# EAGLE design 13VSOIC2DIL-20110605-01 (EAGLE 5.11)
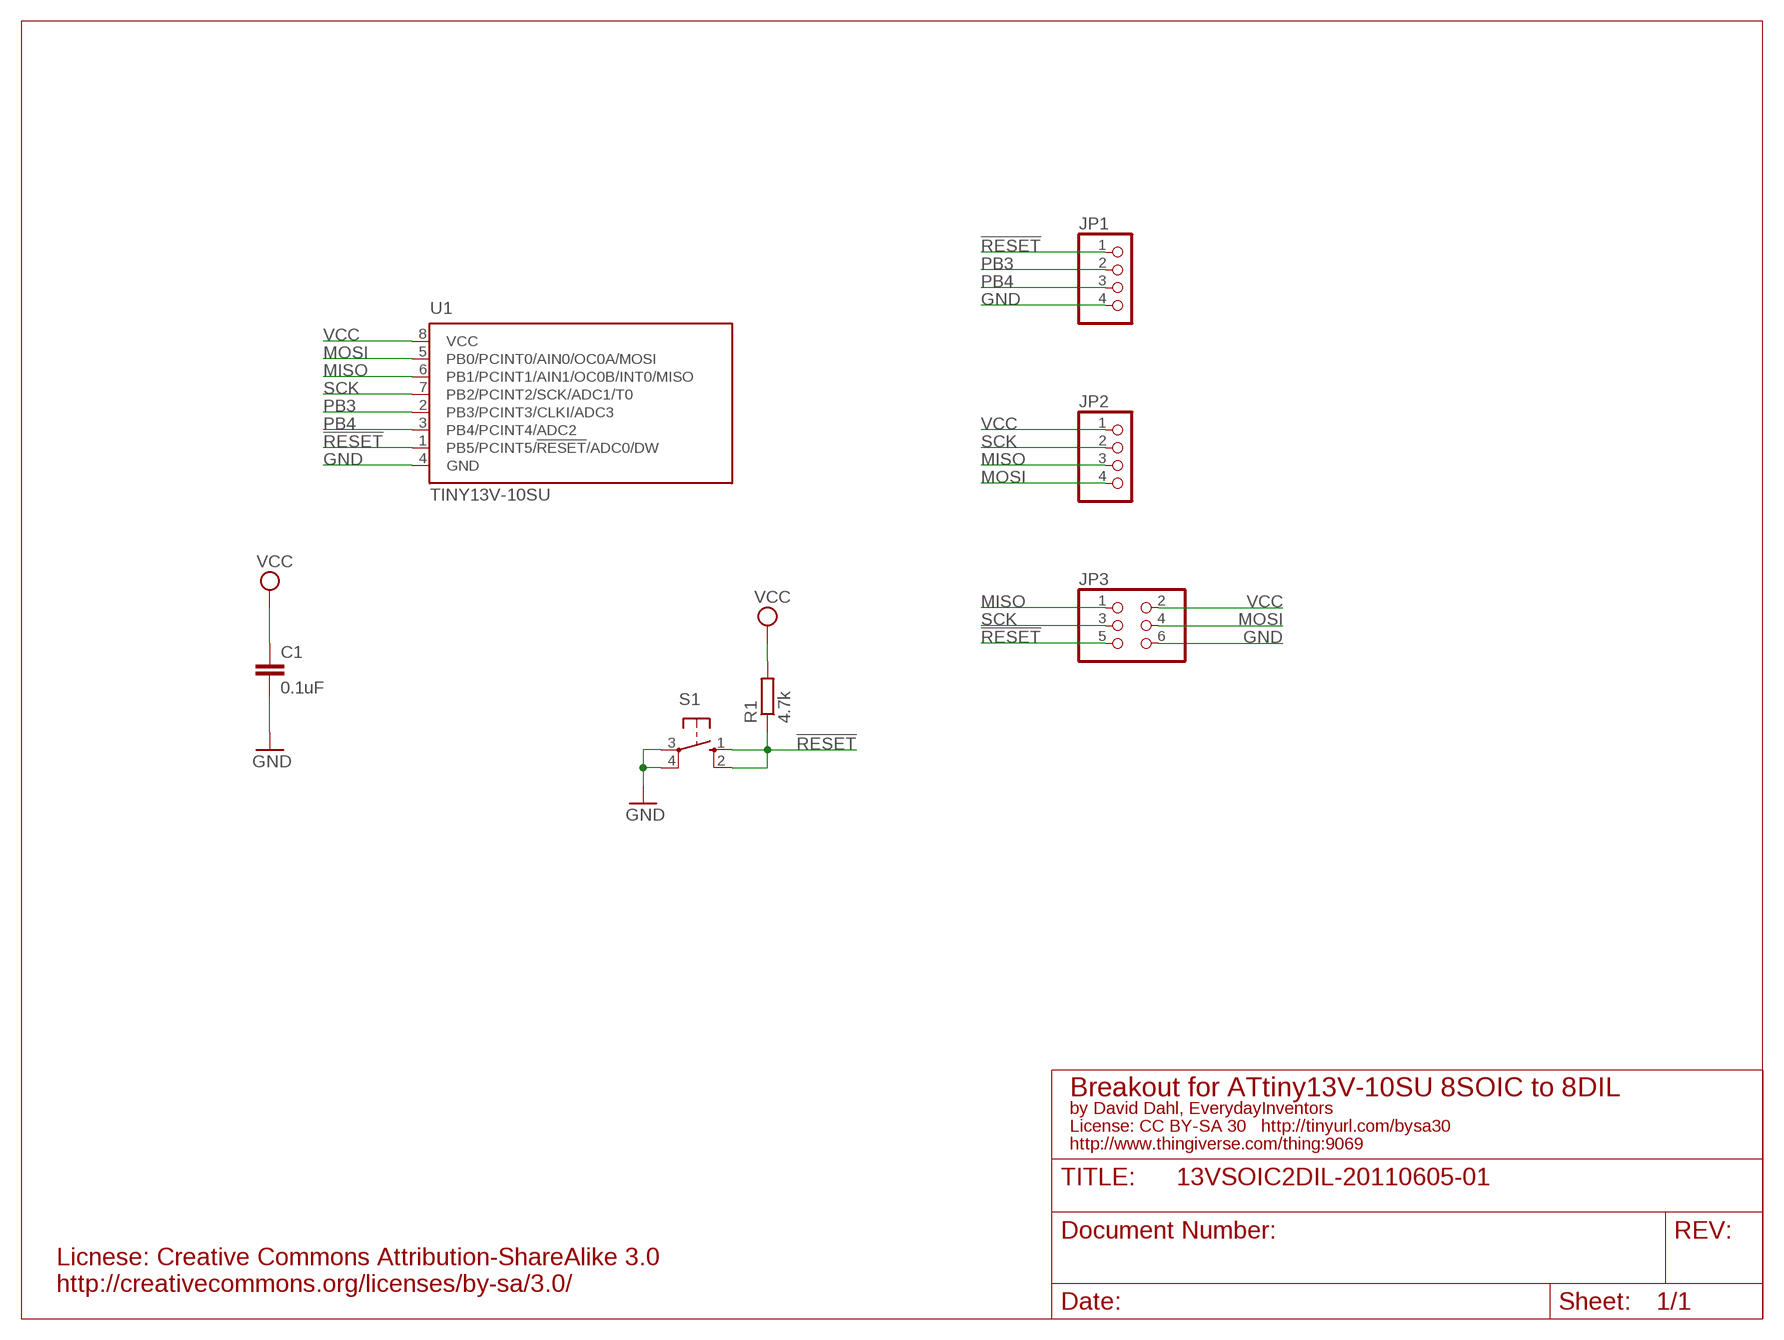
[diagram p0: schematic, sheet 1]

## Parts
C1  0.1uF  C-EU025-025X050  [C025-025X050]
JP1  PINHD-1X04_2.54-S  [1X04-S]
JP2  PINHD-1X04_2.54-S  [1X04-S]
JP3  PINHD-2X3  [2X03]
R1  4.7k  R-EU_0207/10  [0207/10]
S1  10-XX  [B3F-10XX]
U1  TINY13V-10SU  [8S2]

## Nets
!RESET: JP1.1 JP3.5 R1.1 S1.1(S) S1.2(S1) U1.1(PB5/PCINT5/!RESET!/ADC0/DW)
GND: C1.2 JP1.4 JP3.6 S1.3(P) S1.4(P1) U1.4(GND)
MISO: JP2.3 JP3.1 U1.6(PB1/PCINT1/AIN1/OC0B/INT0/MISO)
MOSI: JP2.4 JP3.4 U1.5(PB0/PCINT0/AIN0/OC0A/MOSI)
PB3: JP1.2 U1.2(PB3/PCINT3/CLKI/ADC3)
PB4: JP1.3 U1.3(PB4/PCINT4/ADC2)
SCK: JP2.2 JP3.3 U1.7(PB2/PCINT2/SCK/ADC1/T0)
VCC: C1.1 JP2.1 JP3.2 R1.2 U1.8(VCC)

## Notes on the sheet
- Breakout for ATtiny13V-10SU 8SOIC to 8DIL
- by David Dahl, EverydayInventors
- License: CC BY-SA 30   http://tinyurl.com/bysa30
- http://www.thingiverse.com/thing:9069
- Licnese: Creative Commons Attribution-ShareAlike 3.0
- http://creativecommons.org/licenses/by-sa/3.0/

## Library data of the parts
C1 = rcl:C-EU: CAPACITOR, European symbol
JP1 JP2 = pinhead-2:PINHD-1X04: PIN HEADER
JP3 = pinhead:PINHD-2X3: PIN HEADER
R1 = rcl:R-EU_: RESISTOR, European symbol
S1 = switch-omron:10-XX: OMRON SWITCH; MPN: B3F-1000; OC_FARNELL: 176432; OC_NEWARK: 36M3542
U1 = atmel:TINY13: 8-bit AVR Microcontroller with 1K Bytes In-System Programmable Flash Source: http://www.atmel.com/dyn/resources/prod_documents/2535S.pdf; MPN: ATTINY13V-10SU; OC_FARNELL: 9171584; OC_NEWARK: 96K6524

## Board
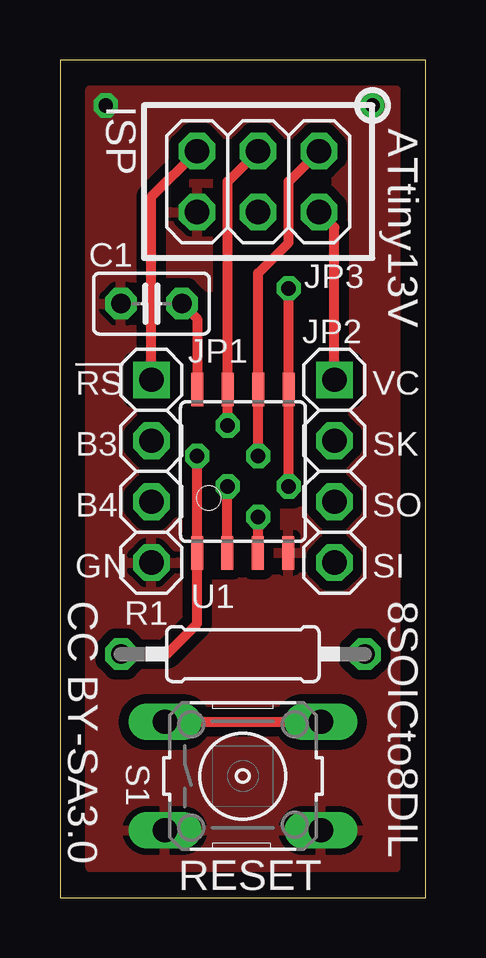
[diagram p1: board, top side]
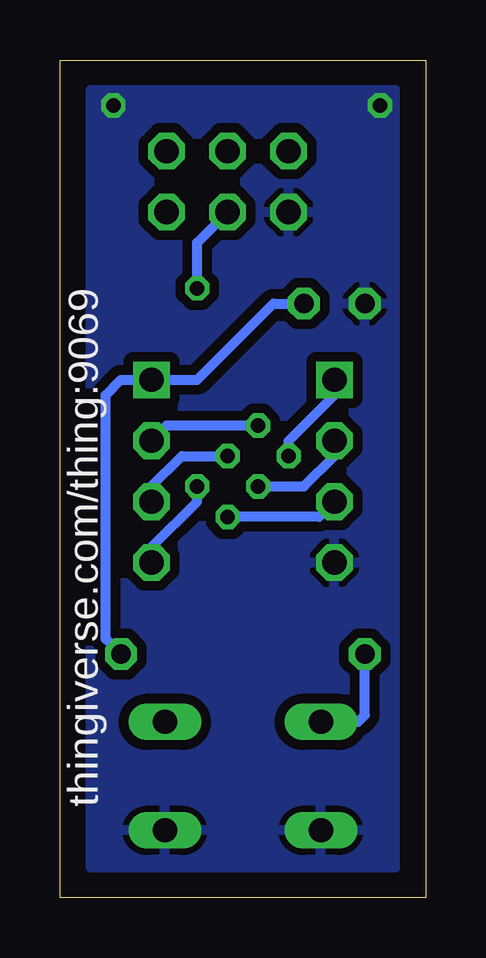
[diagram p2: board, bottom side, seen from below]

Size 15.24 x 34.91 mm. Coordinates in mm from the lower left corner, seen from the top.
Outline: 0,0 15.24,0 15.24,34.91 0,34.91 0,0
Copper layers (1*16): Top 0.035mm / dielectric 1.5mm / Bottom 0.035mm
Design rules "default *": minimum track width 10mil, minimum drill 24mil, track to track 8mil, track to pad 8mil, pad to pad 8mil, via to via 8mil, smd to smd 8mil, copper to edge 40mil, drill to drill 8mil, minimum pad ring 10mil, minimum via ring 8mil, stop-mask expansion 4mil, vias tented up to drill 24mil, thermal gap 10mil

### Footprints (pad centres in the part's own frame; a part is rotated, then mirrored left to right if it is on the bottom)
C025-025X050 = drill 0.813 octagon: 1 -1.27,0; 2 1.27,0
1X04-S = drill 1.016 square: 1 -3.81,0 | drill 1.016 octagon: 2 -1.27,0; 3 1.27,0; 4 3.81,0
2X03 = drill 1.016 octagon: 1 -2.54,-1.27; 2 -2.54,1.27; 3 0,-1.27; 4 0,1.27; 5 2.54,-1.27; 6 2.54,1.27
0207/10 = drill 0.813 octagon: 1 -5.08,0; 2 5.08,0
B3F-10XX = drill 1.016 long: 1 -3.251,2.261; 2 3.251,2.261; 3 -3.251,-2.261; 4 3.251,-2.261
8S2 = smd 0.5 x 1.4: 1 -1.905,-3.404; 2 -0.645,-3.404; 3 0.625,-3.404; 4 1.895,-3.404; 5 1.905,3.404; 6 0.635,3.404; 7 -0.635,3.404; 8 -1.905,3.404

### Placement (x,y rotation side)
C1  3.81,24.77 180 top
JP1  3.81,17.78 270 top
JP2  11.43,17.78 270 top
JP3  8.26,29.84 180 top
R1  7.62,10.16 0 top
S1  7.62,5.08 0 top
U1  7.62,17.78 0 top

### Tracks (layer width: path | path; a pad name or v marks a point on that pad's centre or on a via)
!RESET  (via drill 0.6)
  Top 0.406: JP1.1 3.81,29.21 JP3.5 | v5.71,18.41 U1.1 5.71,11.43 4.45,10.16 R1.1 | S1.1 S1.2
  Bottom 0.406: v5.71,18.41 5.71,19.05 3.81,20.95 JP1.1 | S1.1 2.82,7.34 2.54,7.62 R1.1
GND  (via drill 0.6)
  other vias: 1.91,33.02 13.02,33.02
  pour Top (isolate 0.406): 1.27,33.66 13.97,33.66 13.97,1.27 1.27,1.27
  pour Bottom (isolate 0.406): 13.97,1.27 1.27,1.27 1.27,33.66 13.97,33.66
MISO  (via drill 0.6)
  Top 0.406: v8.26,18.41 U1.6 8.26,26.04 9.53,27.3 9.53,29.84 JP3.1
  Bottom 0.406: v8.26,18.41 10.16,18.41 11.43,17.14 JP2.3
MOSI  (via drill 0.6)
  Top 0.406: v9.53,17.14 U1.5 v9.53,25.4
  Bottom 0.406: v9.53,17.14 9.53,16.51 11.43,14.61 JP2.4 | v9.53,25.4 9.53,27.3 JP3.4
PB3  (via drill 0.6)
  Top 0.406: U1.2 6.97,17.14 v6.99,17.14
  Bottom 0.406: v6.99,17.14 5.08,17.14 3.81,18.41 JP1.2
PB4  (via drill 0.6)
  Top 0.406: U1.3 8.24,15.87 v8.26,15.88
  Bottom 0.406: v8.26,15.88 4.45,15.88 JP1.3
SCK  (via drill 0.6)
  Top 0.406: v6.99,19.68 U1.7 6.99,29.84 JP3.3
  Bottom 0.406: v6.99,19.68 10.79,19.68 JP2.2
VCC
  Top 0.406: JP2.1 11.43,27.94 JP3.2 | C1.1 5.71,24.13 U1.8
  Bottom 0.406: C1.1 6.35,24.77 9.53,21.59 JP2.1 12.7,21.59 13.34,20.95 13.34,10.79 R1.2

### Text on the board
tPlace: ISP | ATtiny13V | !RS | VC | B3 | SK | B4 | SO | GN | SI | CC BY-SA3.0 | 8SOICto8DIL | RESET
bPlace: thingiverse.com/thing:9069